# Altium schematic sheet battery.SchDoc
size A; SheetNumber: 6; SheetTotal: 10
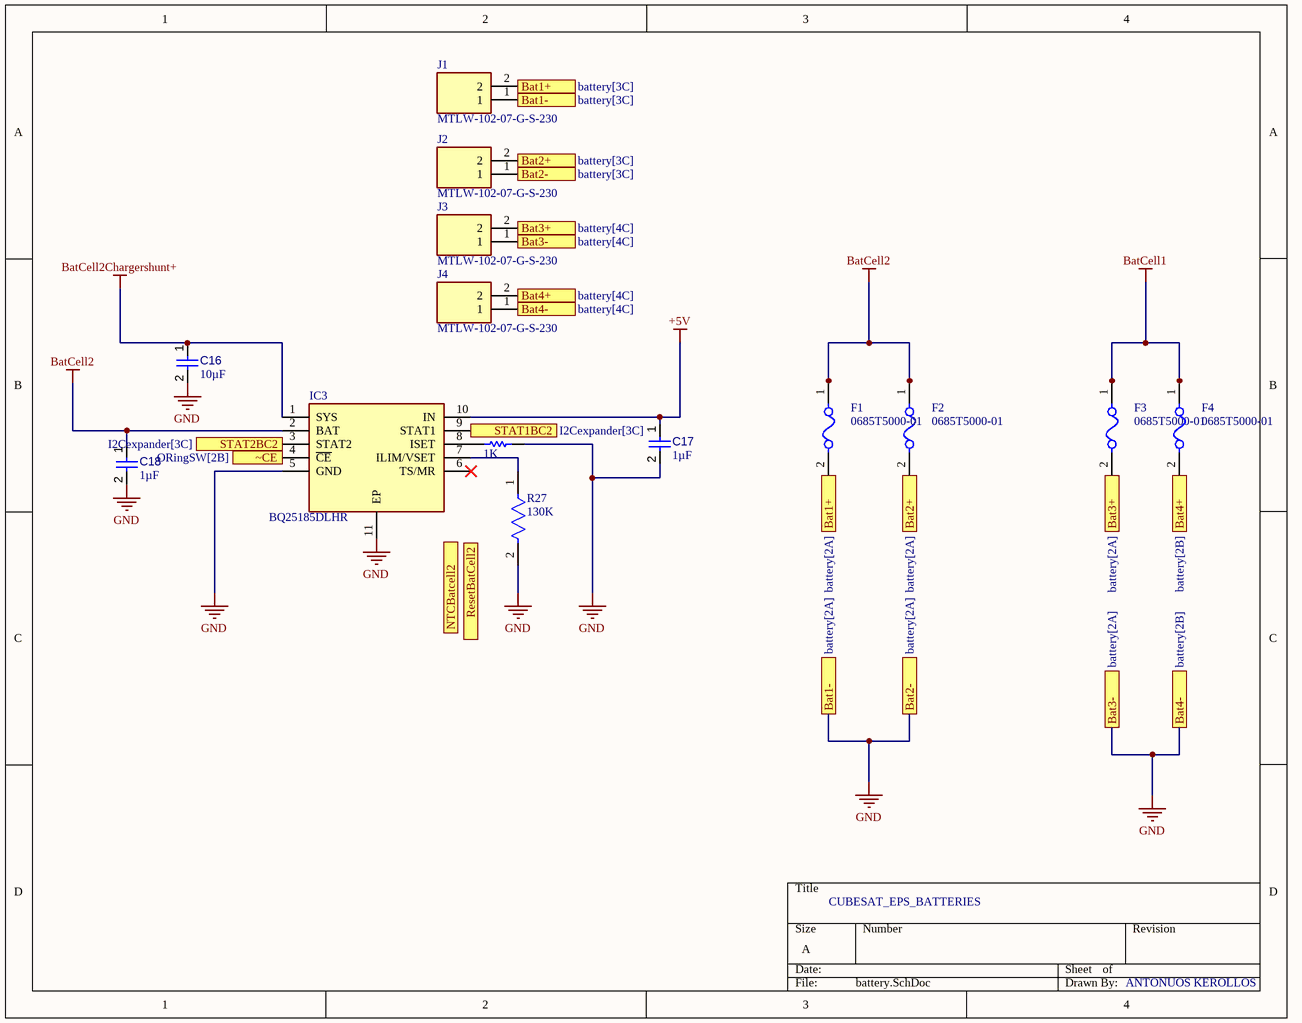
[diagram p0: battery.SchDoc]

## Parts
C16  value 10µF  [CAPC0402(1005)60_L]  (hidden comment: Capacitor 10µF +/-40% 6.3V 0402)
C17  value 1µF  [CAPC0402(1005)60_L]  (hidden comment: Capacitor 1µF +/-20% 10V 0402)
C18  value 1µF  [CAPC0402(1005)60_L]  (hidden comment: Capacitor 1µF +/-20% 10V 0402)
F1  0685T5000-01  [FP-0685T-MFG]
F2  0685T5000-01  [FP-0685T-MFG]
F3  0685T5000-01  [FP-0685T-MFG]
F4  0685T5000-01  [FP-0685T-MFG]
IC3  BQ25185DLHR  [SON40P220X200X80-11N]
J1  MTLW-102-07-G-S-230  [HDRV2W82P0X254_1X2_508X249X876P]
J2  MTLW-102-07-G-S-230  [HDRV2W82P0X254_1X2_508X249X876P]
J3  MTLW-102-07-G-S-230  [HDRV2W82P0X254_1X2_508X249X876P]
J4  MTLW-102-07-G-S-230  [HDRV2W82P0X254_1X2_508X249X876P]
R26  1K  [RESC2013X60X35ML10T20]
R27  130K  [FP-CRCW0805-e3-IPC_C]

## Ports
Bat1+ (see battery[2A]), Bat1+ (see battery[3C]), Bat1- (see battery[2A]), Bat1- (see battery[3C]), Bat2+ (see battery[2A]), Bat2+ (see battery[3C]), Bat2- (see battery[2A]), Bat2- (see battery[3C]), Bat3+ (see battery[2A]), Bat3+ (see battery[4C]), Bat3- (see battery[2A]), Bat3- (see battery[4C]), Bat4+ (see battery[2B]), Bat4+ (see battery[4C]), Bat4- (see battery[2B]), Bat4- (see battery[4C]), NTCBatcell2, ResetBatCell2, STAT1BC2 (see I2Cexpander[3C]), STAT2BC2 (see I2Cexpander[3C]), ~CE (see ORingSW[2B])

## Nets
+5V: C17.1 IC3.10(IN)
BatCell1: F3.1 F4.1
BatCell2: C18.1 F1.1 F2.1 IC3.2(BAT)
BatCell2Chargershunt+: C16.1 IC3.1(SYS)
GND: C16.2 C17.2 C18.2 IC3.5(GND) IC3.11(EP) J1.1 J2.1 J3.1 J4.1 R26.1 R27.2 ; port Bat1-, port Bat2-, port Bat3-, port Bat4-
Bat1+: F1.2 J1.2 ; port Bat1+
Bat2+: F2.2 J2.2 ; port Bat2+
Bat3+: F3.2 J3.2 ; port Bat3+
Bat4+: F4.2 J4.2 ; port Bat4+
STAT1BC2: IC3.9(STAT1) ; port STAT1BC2
STAT2BC2: IC3.3(STAT2) ; port STAT2BC2
~CE: IC3.4(~{CE}) ; port ~CE
NetIC3_7: IC3.7(ILIM/VSET) R27.1
NetIC3_8: IC3.8(ISET) R26.2

Not connected (* = marked no-connect by the designer): IC3 6(TS/MR)*

## Notes on the sheet
- CUBESAT_EPS_BATTERIES
- ANTONUOS KEROLLOS

## Library data of the parts
C16 = CMP-001-00074-3: Chip Capacitor, 10µF +/-40%, 6.3V, 0402, Thickness 0.6 mm; Tolerance: 10%; Case/Package: 0402; Pins: 2; Mounting Technology: SMT; Voltage Rating: 6.3V; Max Operating Temperature: 85°C; Min Operating Temperature: -55°C
C17 C18 = CMP-001-00063-3: Chip Capacitor, 1µF +/-20%, 10V, 0402, Thickness 0.6 mm; Tolerance: 10%; Mounting Technology: SMT; Max Operating Temperature: 85°C; Voltage Rating: 10V; Pins: 2; Case/Package: 0402; Min Operating Temperature: -55°C
F1-F4 = CMP-16042-000006-1: FUSE BOARD MNT 5A 63VAC/VDC 1206; RoHS Compliant: Yes
IC3 = BQ25185DLHR: Integrated Circuit; Manufacturer_Name: Texas Instruments; Datasheet Link: https://www.ti.com/lit/ds/symlink/bq25185.pdf?ts=1706857561339&ref_url=https%253A%252F%252Fwww.ti.com%252Fproduct%252FBQ25185; Height: 0.8mm; Manufacturer_Part_Number: BQ25185DLHR; Mouser Part Number: 595-BQ25185DLHR; Mouser Price/Stock: https://www.mouser.co.uk/ProductDetail/Texas-Instruments/BQ25185DLHR?qs=Z%252BL2brAPG1IbO%2FV3RqsaPw%3D%3D
J1-J4 = MTLW-102-07-G-S-230: Connector; Manufacturer_Name: SAMTEC; Datasheet Link: https://componentsearchengine.com/Datasheets/1/MTLW-102-07-G-S-230.pdf; Height: 8.76mm; Manufacturer_Part_Number: MTLW-102-07-G-S-230; Mouser Part Number: 200-MTLW10207GS230; Mouser Price/Stock: https://www.mouser.com/Search/Refine.aspx?Keyword=200-MTLW10207GS230; Arrow Part Number: MTLW-102-07-G-S-230; Arrow Price/Stock: https://www.arrow.com/en/products/mtlw-102-07-g-s-230/samtec
R26 = CMP-2100-03671-1: Chip Resistor, 1 KOhm, +/- 1%, 125 mW, -55 to 155 degC, 0805 (2012 Metric), RoHS, Tape and Reel; Manufacturer: Yageo; Temperature Coefficient: 100ppm/degreesC; Voltage Rating (DC): 150V; Max Power Dissipation: 125mW; Resistance: 1KOhm; Number of Pins: 2; Number of Terminations: 2; Datasheet URL: http://www.yageo.com/NewPortal/yageodocoutput?fileName=/pdf/R-Chip/PYu-RC_Group_51_RoHS_L_5.pdf; Length: 0.079inch; Package Description: 2-Pin Surface Mounted Device, Body 2 x 1.25 mm; Depth: 1.25mm; Height: 0.024inch; Military Standard: Not; Case/Package: 0805; Package Reference: 0805; RoHSCompliant: true; Lead Free: LeadFree; Packaging: TapeandReel; Package Quantity: 1; Datasheet Version: Rev. 5, 10/2016; Tolerance: 1%; Min Operating Temperature: -55degC; Voltage Rating: 150V; Composition: ThickFilm; Case Code (Imperial): 0805; Power Rating: 125mW; Width: 0.049inch; Case Code (Metric): 2012; Manufacturer URL: http://www.yageo.com/; Max Operating Temperature: 155degC; REACH SVHC: Unknown; Termination: SMD/SMT
R27 = CMP-2001-04940-2: RES Thick Film, 130kΩ, 1%, 0.125W, 100ppm/°C, 0805; Working Voltage: 150V; Resistance: 130kR; Max Power Dissipation: 125mW; Case/Package: 0805; Packaging: Tape and Reel; Max Operating Temperature: 155°C; Military Standard: Not; Min Operating Temperature: -55°C; Composition: Thick Film; Package Quantity: 10; Width: 1.25mm; Number of Pins: 2; Mount: Surface Mount; Lead Free: Lead Free; Termination: SMD/SMT; Weight: 0.000194oz; Features: Automotive AEC-Q200; Radiation Hardening: No; Case Code (Imperial): 0805; Depth: 1.25mm; Voltage Rating (DC): 150V; Length: 2mm; Number of Terminations: 2; Power Rating: 125mW; Case Code (Metric): 2012; Voltage Rating: 150V; Contact Plating: Tin; Temperature Coefficient: 100ppm/°C; Tolerance: 1%; Height: 0.45mm